# EasyEDA Pro project MSPM0G3507逐飞核心板.eprj

# Schematic Schematic1
Board Name: Board1; Create Date: 2025-07-05; Page Name: P1; Project Name: MSPM0G3507逐飞核心板; Schematic Name: Schematic1; Update Date: 2025-07-06; Company: 嘉立创EDA; Page Size: A4; Version: V1.0
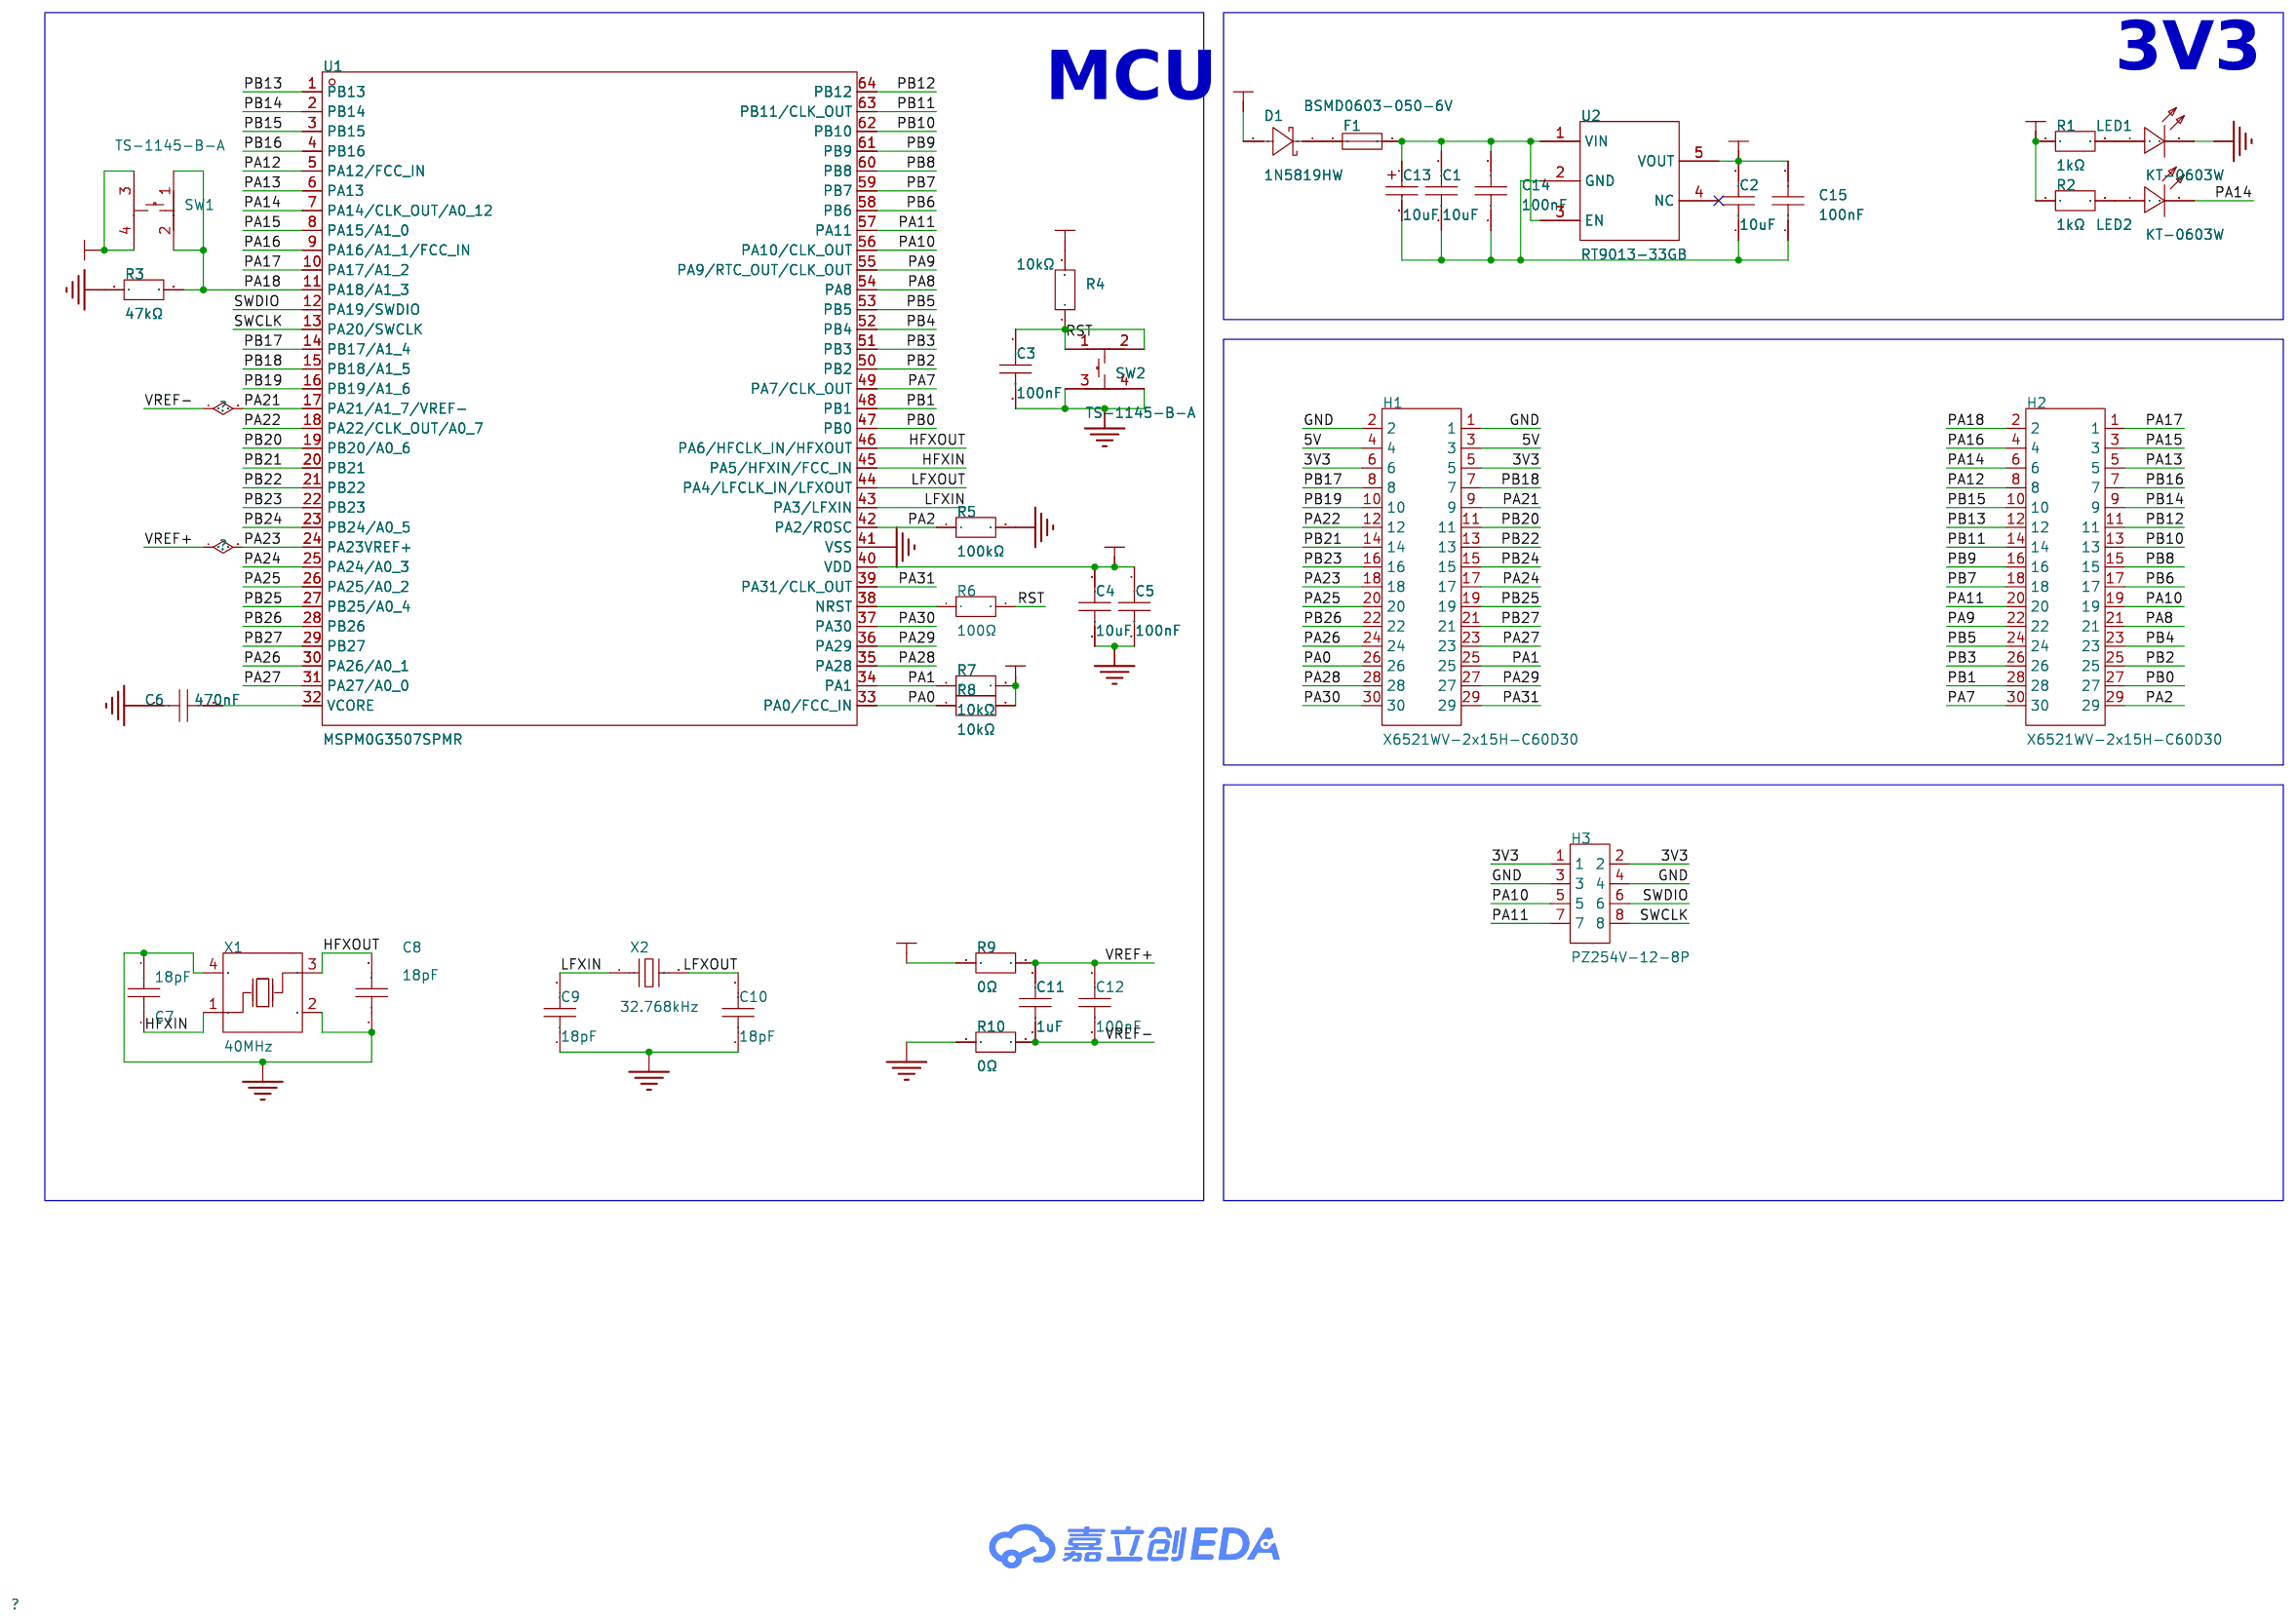
[diagram p0: schematic sheet]

## Parts
C1  10uF  [C0603]
C2  10uF  [C0603]
C3  100nF  [C0402]
C4  10uF  [C0603]
C5  100nF  [C0402]
C6  470nF  [C0402]
C7  18pF  [C0402]
C8  18pF  [C0402]
C9  18pF  [C0402]
C10  18pF  [C0402]
C11  1uF  [C0402]
C12  100nF  [C0402]
C13  10uF  [CAP-SMD_L3.2-W1.6-RD-C7171]
C14  100nF  [C0402]
C15  100nF  [C0402]
D1  1N5819HW  [SOD-123_L2.7-W1.6-LS3.7-RD-1]
F1  BSMD0603-050-6V  [F0603]
H1  X6521WV-2x15H-C60D30  [HDR-TH_30P-P2.54-V-M-R2-C15-S2.54-BL]
H2  X6521WV-2x15H-C60D30  [HDR-TH_30P-P2.54-V-M-R2-C15-S2.54-BL]
H3  PZ254V-12-8P  [HDR-TH_8P-P2.54-V-M-R2-C4-S2.54]
LED1  KT-0603W  [LED0603-R-RD_WHITE]
LED2  KT-0603W  [LED0603-R-RD_WHITE]
R1  1kΩ  [R0603]
R2  1kΩ  [R0603]
R3  47kΩ  [R0402]
R4  10kΩ  [R0402]
R5  100kΩ  [R0402]
R6  100Ω  [R0402]
R7  10kΩ  [R0603]
R8  10kΩ  [R0603]
R9  0Ω  [R0402]
R10  0Ω  [R0402]
SW1  TS-1145-B-A  [SW-SMD_4P-L4.2-W3.2-P2.15-LS4.6-2]
SW2  TS-1145-B-A  [SW-SMD_4P-L4.2-W3.2-P2.15-LS4.6-2]
U1  MSPM0G3507SPMR  [LQFP-64_L10.0-W10.0-P0.50-LS12.0-BL]
U2  RT9013-33GB  [SOT-23-5_L3.0-W1.7-P0.95-LS2.8-BL]
X1  40MHz  [OSC-SMD_4P-L3.2-W2.5-BL_SIT8008BI]
X2  32.768kHz  [OSC-SMD_L3.2-W1.5]

## Library data of the parts
C1 C2 = CGA0603X5R106K100JT: 容值:10uF;精度:±10%;额定电压:10V;材质(温度系数):X5R;; LCSC Part Name: 10uF ±10% 10V; Supplier Part: C6119842; Manufacturer: HRE(芯声); Supplier Footprint: 0603; JLCPCB Part Class: 扩展库; Supplier: LCSC; Tolerance: ±10%; Voltage Rated: 10V; Temperature Coefficient: X5R
C3 C5 C12 = CGA2B3X5R1H104K050BB: LCSC Part Name: 100nF ±10% 50V; Supplier Part: C2168987; Manufacturer: TDK; Supplier Footprint: 0402; JLCPCB Part Class: 扩展库; Datasheet: https://atta.szlcsc.com/upload/public/pdf/source/20210430/BD8671736ED62E65BA506F30C3AAED50.pdf; Supplier: LCSC; Tolerance: ±10%; Voltage Rated: 50V; Temperature Coefficient: X5R
C4 = 10uF_C15415: LCSC Part Name: 10uF ±20% 16V; Supplier Part: C15415; Manufacturer: SAMSUNG(三星); Supplier Footprint: 0603; JLCPCB Part Class: 扩展库; Datasheet: https://atta.szlcsc.com/upload/public/pdf/source/20160218/1457707763339.pdf; Supplier: LCSC; Tolerance: ±20%; Voltage Rated: 16V
C6 = C1005X5R1V474K050BC: LCSC Part Name: 470nF ±10% 35V; Supplier Part: C3852634; Manufacturer: TDK; Supplier Footprint: 0402; JLCPCB Part Class: 扩展库; Datasheet: https://atta.szlcsc.com/upload/public/pdf/source/20230606/A83975C7E70EF5AFCD4A17254ABD78F2.pdf; Supplier: LCSC; Tolerance: ±10%; Voltage Rated: 35V; Temperature Coefficient: X5R
C7-C10 = RF15N180J500CT: LCSC Part Name: 18pF ±5% 50V; Supplier Part: C384679; Manufacturer: Walsin(华新科); Supplier Footprint: 0402; JLCPCB Part Class: 扩展库; Datasheet: https://atta.szlcsc.com/upload/public/pdf/source/20190416/C384705_313B75924A9FB4466C261D14903A5486.pdf; Supplier: LCSC; Tolerance: ±5%; Voltage Rated: 50V; Temperature Coefficient: NP0
C11 = CGB2A1X5R1A105K033BC: LCSC Part Name: 1uF ±10% 10V; Supplier Part: C2169193; Manufacturer: TDK; Supplier Footprint: 0402; JLCPCB Part Class: 扩展库; Datasheet: https://atta.szlcsc.com/upload/public/pdf/source/20191105/C343012_3F47E91403558E3EBEE82CA44A798D40.pdf; Supplier: LCSC; Tolerance: ±10%; Voltage Rated: 10V; Temperature Coefficient: X5R
C13 = TAJA106K016RNJ: LCSC Part Name: 10uF ±10% 16V; Supplier Part: C7171; Manufacturer: Kyocera AVX; Supplier Footprint: CASE-A-3216-18(mm); JLCPCB Part Class: 基础库; Supplier: LCSC; Tolerance: ±10%; Voltage Rating: 16V; Equivalent Series Resistance(ESR): 3Ω@100kHz; Operating Temperature: -55℃~+125℃
C14 C15 = CL05B104KB54PNC: LCSC Part Name: 100nF ±10% 50V; Supplier Part: C307331; Manufacturer: SAMSUNG(三星); Supplier Footprint: 0402; JLCPCB Part Class: 基础库; Datasheet: https://atta.szlcsc.com/upload/public/pdf/source/20160218/1457707763339.pdf; Supplier: LCSC; Tolerance: ±10%; Voltage Rated: 50V; Temperature Coefficient: X7R
D1 = 1N5819HW: 二极管配置:-;正向压降(Vf):900mV@3A;直流反向耐压(Vr):40V;平均整流电流(Io):1A;; LCSC Part Name: 电压:40V 电流:1A; Supplier Part: C2905649; Manufacturer: TECH PUBLIC(台舟); Supplier Footprint: SOD-123; JLCPCB Part Class: 扩展库; Datasheet: https://atta.szlcsc.com/upload/public/pdf/source/20211020/8C6B6169F42B21129AF0D528B0E96B00.pdf; Supplier: LCSC; Forward Voltage (Vf@If): 900mV@3A; Reverse Voltage (Vr): 40V; Average Rectified Current (Io): 1A; Reverse Leakage Current (Ir): 1mA@40V
F1 = BSMD0603-050-6V: LCSC Part Name: 6V 500mA 0603自恢复; Supplier Part: C883095; Manufacturer: BHFUSE(佰宏); Supplier Footprint: 0603; JLCPCB Part Class: 扩展库; Datasheet: https://atta.szlcsc.com/upload/public/pdf/source/20230512/E478DE3555A0061DA0124A9F45802B86.pdf; Supplier: LCSC; Operating Voltage (Max): 6V; Current Rating (Max): 40A; Hold Current: 500mA; Trip Current: 1A; Power Dissipation: 500mW; Resistance - Initial (Ri) (Min): 100mΩ; Resistance - Post Trip (R1) (Max): 800mΩ; Maximum Time to Trip: 100ms; Operating Temperature: -40℃~+85℃
H1 H2 = X6521WV-2x15H-C60D30: LCSC Part Name: 2x15P 间距:2.54mm 方针; Supplier Part: C725887; Manufacturer: XKB Connection(中国星坤); Supplier Footprint: 插件,P=2.54mm; JLCPCB Part Class: 扩展库; Datasheet: https://atta.szlcsc.com/upload/public/pdf/source/20230814/F1C4971E164A170E66FC7330ABFF6881.pdf; Supplier: LCSC; Pin Structure: 2x15P; Pitch: 2.54mm; Row Spacing: 2.54mm; Circluar Pins/Square Pins: 方针; Number of Rows: 双排; Number of Pins: 30P; Current Rating: 3A; Voltage Rating (Max): 250V; Insulation Height: 2.5mm; Contact Material: 黄铜; Contact Plating: 金; Operating Temperature: -40℃~+105℃; Color: 黑色
H3 = PZ254V-12-8P: LCSC Part Name: 2x4P 间距:2.54mm 方针 直插; Supplier Part: C492421; Manufacturer: XFCN(兴飞); Supplier Footprint: 插件,P=2.54mm; JLCPCB Part Class: 扩展库; Datasheet: https://atta.szlcsc.com/upload/public/pdf/source/20200309/C492421_DC8A206AF99CD7755BD4A5B0BC48200B.pdf; Supplier: LCSC; Pin Structure: 2x4P; Pitch: 2.54mm; Row Spacing: 2.54mm; Circluar Pins/Square Pins: 方针; Mounting Type: 直插; Number of Rows: 双排; Number of Pins: 8P; Length of Mating Pin: 6mm; Insulation Height: 2.5mm; Length of End Connection Pin: 3mm; Contact Material: 黄铜; Operating Temperature: -40℃~+105℃; Color: 黑色
LED1 LED2 = KT-0603W: LCSC Part Name: 0603 白灯 高亮; Supplier Part: C2290; Manufacturer: KENTO; Supplier Footprint: 0603; JLCPCB Part Class: 基础库; Datasheet: https://atta.szlcsc.com/upload/public/pdf/source/20221101/4C23D5C85BA051E44A00B833D0A41468.pdf; Supplier: LCSC; Emitted Color: 白色
R1 R2 = SY0603BD1KP: LCSC Part Name: 厚膜电阻 1kΩ ±0.1% 62.5mW; Supplier Part: C2913953; Manufacturer: SANYEAR(叁叶源); Supplier Footprint: 0603; JLCPCB Part Class: 扩展库; Datasheet: https://atta.szlcsc.com/upload/public/pdf/source/20210413/C2763786_98157E1BD2D9D1A8B4147C58C12D38F2.pdf; Supplier: LCSC; Type: 厚膜电阻; Tolerance: ±0.1%; Power(Watts): 62.5mW; Temperature Coefficient: ±25ppm/℃
R3 = TD03H4702FT: LCSC Part Name: 47kΩ ±1% 100mW; Supplier Part: C7471593; Manufacturer: FH(风华); Supplier Footprint: 0603; JLCPCB Part Class: 扩展库; Datasheet: https://atta.szlcsc.com/upload/public/pdf/source/20230801/D9B071711038885C5E715CC01846F136.pdf; Supplier: LCSC; Tolerance: ±1%; Power(Watts): 100mW; Temperature Coefficient: ±50ppm/℃
R4 R5 R7 R8 = RG1608N-103-D-T5: LCSC Part Name: 薄膜电阻 10kΩ ±0.5% 100mW; Supplier Part: C2146774; Manufacturer: SUSUMU; Supplier Footprint: 0603; JLCPCB Part Class: 扩展库; Datasheet: https://atta.szlcsc.com/upload/public/pdf/source/20210604/C332225_945ECB787E58A490E925D92B7707E1BB.pdf; Supplier: LCSC; Type: 薄膜电阻; Tolerance: ±0.5%; Power(Watts): 100mW; Voltage-Supply(Max): 100V; Temperature Coefficient: ±10ppm/℃; Operating Temperature: -55℃~+155℃
R6 = RNCP0603FTD100R: LCSC Part Name: 薄膜电阻 100Ω ±1% 125mW; Supplier Part: C2479153; Manufacturer: SEI(Stackpole Electronics Inc.); Supplier Footprint: 0603; JLCPCB Part Class: 扩展库; Datasheet: https://atta.szlcsc.com/upload/public/pdf/source/20210703/569BB8B726E815480678B80ABD78296B.pdf; Supplier: LCSC; Type: 薄膜电阻; Tolerance: ±1%; Power(Watts): 125mW; Overload Voltage (Max): 150V; Temperature Coefficient: ±100ppm/℃; Operating Temperature Range: -55℃~+155℃
R9 R10 = SCR0402J0R: LCSC Part Name: 厚膜电阻 0Ω ±5% 62.5mW; Supplier Part: C3017451; Manufacturer: VO(翔胜); Supplier Footprint: 0402; JLCPCB Part Class: 扩展库; Datasheet: https://atta.szlcsc.com/upload/public/pdf/source/20220513/247AF9639BA21CF93567DC289CCC6A22.pdf; Supplier: LCSC; Type: 厚膜电阻; Tolerance: ±5%; Power(Watts): 62.5mW; Overload Voltage (Max): 50V; Operating Temperature Range: -55℃~+155℃
SW1 SW2 = TS-1145-B-A: 电路结构:单刀单掷;按钮形状:椭圆形按钮;作用力:160gf;安装方式:立贴;开关长度:4.2mm;开关宽度:3.2mm;开关高度:2.5mm;带支架:不带;触点电流:50mA;额定电压(DC):12V;绝缘电阻:-;带灯:无;机械寿命:10万次;; LCSC Part Name: 4.2*3.2*2.5mm 立贴 轻触开关; Supplier Part: C561524; Manufacturer: XKB Connectivity(中国星坤); Supplier Footprint: SMD; JLCPCB Part Class: 扩展库; Datasheet: https://atta.szlcsc.com/upload/public/pdf/source/20211011/0CF8142AA4E06969C17548F8C3FC4FC4.pdf; Supplier: LCSC; Circuit: 单刀单掷; Actuator Style: 椭圆形按钮; Operating Force: 160gf; Mounting Style: 立贴; Switch Length: 4.2mm; Switch Width: 3.2mm; Switch Height: 2.5mm; Strike Gundam: 不带; Contact Current: 50mA; Voltage Rating (DC): 12V; Actuator/Cap Color: 白色; With Lamp: 无; Mechanical Life: 10万次; Operating Temperature: -30℃~+85℃
U1 = MSPM0G3507SPMR_C22389960: Supplier Part: C22389960; Manufacturer: TI(德州仪器); Supplier Footprint: LQFP-64(10x10); JLCPCB Part Class: 扩展库; Supplier: LCSC
U2 = RT9013-33GB: 输出类型:固定;最大输入电压:5.5V;输出电压:3.3V;输出电流:500mA;电源纹波抑制比(PSRR):50dB@(10kHz);输出极性:正极;; LCSC Part Name: 输入5.5V 输出3.3V 500mA; Supplier Part: C47773; Manufacturer: RICHTEK(立锜); Supplier Footprint: SOT-23-5; JLCPCB Part Class: 扩展库; Datasheet: https://atta.szlcsc.com/upload/public/pdf/source/20150504/1457707282459.pdf; Supplier: LCSC; Output Type: 固定; Maximum Input Voltage: 5.5V; Output Voltage: 3.3V; Output Current: 500mA; Power Supply Rejection Ratio (PSRR): 50dB@(10kHz); Dropout Voltage: 400mV@(500mA); standby current: 50uA; Feature: 低ESR；防静电保护；热保护(TSD)；过流保护(OCP)；带使能; Operating Temperature: -40℃~+85℃; Output Polarity: 正极; Number of Outputs: 1
X1 = X322540MPB4SI: LCSC Part Name: YSX321SL 40MHZ 4P 3225 15PF ±10PPM -40~85℃ (±20PPM); Supplier Part: C9010; Manufacturer: YXC(扬兴晶振); Supplier Footprint: SMD3225-4P; JLCPCB Part Class: 扩展库; Datasheet: https://atta.szlcsc.com/upload/public/pdf/source/20240329/19D5F850207469550BEB00D7DFEDBC7A.pdf; Supplier: LCSC; Type: 贴片晶振; Normal temperature Frequency Tolerance: ±10ppm; Load Capacitance: 15pF; Frequency Stability: ±20ppm; Operating Temperature: -40℃~+85℃
X2 = X321532768KGD2SI: LCSC Part Name: YST310S 32.768KHZ 2P 3215 12.5PF ±20PPM -40~85℃; Supplier Part: C620155; Manufacturer: YXC(扬兴晶振); Supplier Footprint: SMD3215-2P; JLCPCB Part Class: 扩展库; Datasheet: https://atta.szlcsc.com/upload/public/pdf/source/20240329/3A7650FD985DD0DE85694D3785AB4916.pdf; Supplier: LCSC; Type: 贴片晶振; Normal temperature Frequency Tolerance: ±20ppm; Load Capacitance: 12.5pF; Frequency Stability: ±30ppm; Operating Temperature: -40℃~+85℃

## Nets
3V3: C2.2 C4.1 C5.1 C15.2 H1.5 H1.6 H3.1 H3.2 R1.1 R2.1 R4.2 R7.2 R8.2 R9.1 SW1.3 SW1.4 U1.40(VDD) U2.5(VOUT)
5V: D1.2(A) H1.3 H1.4
GND: C3.2 C4.2 C5.2 C6.1 C7.2 C8.1 C9.1 C10.1 H1.1 H1.2 H3.3 H3.4 LED1.2(K) R3.1 R5.2 R10.1 SW2.3 SW2.4 U1.41(VSS) X1.2(GND) X1.4(GND)
HFXIN: C7.1 U1.45(PA5/HFXIN/FCC_IN) X1.1(OSC1)
HFXOUT: C8.2 U1.46(PA6/HFCLK_IN/HFXOUT) X1.3(OSC2)
LFXIN: C9.2 U1.43(PA3/LFXIN) X2.1
LFXOUT: C10.2 U1.44(PA4/LFCLK_IN/LFXOUT) X2.2
PA0: H1.26 R8.1 U1.33(PA0/FCC_IN)
PA1: H1.25 R7.1 U1.34(PA1)
PA2: H2.29 R5.1 U1.42(PA2/ROSC)
PA7: H2.30 U1.49(PA7/CLK_OUT)
PA8: H2.21 U1.54(PA8)
PA9: H2.22 U1.55(PA9/RTC_OUT/CLK_OUT)
PA10: H2.19 H3.5 U1.56(PA10/CLK_OUT)
PA11: H2.20 H3.7 U1.57(PA11)
PA12: H2.8 U1.5(PA12/FCC_IN)
PA13: H2.5 U1.6(PA13)
PA14: H2.6 LED2.2(K) U1.7(PA14/CLK_OUT/A0_12)
PA15: H2.3 U1.8(PA15/A1_0)
PA16: H2.4 U1.9(PA16/A1_1/FCC_IN)
PA17: H2.1 U1.10(PA17/A1_2)
PA18: H2.2 R3.2 SW1.1 SW1.2 U1.11(PA18/A1_3)
PA21: C11.2 C12.2 H1.9 R10.2 U1.17(PA21/A1_7/VREF-)
PA22: H1.12 U1.18(PA22/CLK_OUT/A0_7)
PA23: C11.1 C12.1 H1.18 R9.2 U1.24(PA23VREF+)
PA24: H1.17 U1.25(PA24/A0_3)
PA25: H1.20 U1.26(PA25/A0_2)
PA26: H1.24 U1.30(PA26/A0_1)
PA27: H1.23 U1.31(PA27/A0_0)
PA28: H1.28 U1.35(PA28)
PA29: H1.27 U1.36(PA29)
PA30: H1.30 U1.37(PA30)
PA31: H1.29 U1.39(PA31/CLK_OUT)
PB0: H2.27 U1.47(PB0)
PB1: H2.28 U1.48(PB1)
PB2: H2.25 U1.50(PB2)
PB3: H2.26 U1.51(PB3)
PB4: H2.23 U1.52(PB4)
PB5: H2.24 U1.53(PB5)
PB6: H2.17 U1.58(PB6)
PB7: H2.18 U1.59(PB7)
PB8: H2.15 U1.60(PB8)
PB9: H2.16 U1.61(PB9)
PB10: H2.13 U1.62(PB10)
PB11: H2.14 U1.63(PB11/CLK_OUT)
PB12: H2.11 U1.64(PB12)
PB13: H2.12 U1.1(PB13)
PB14: H2.9 U1.2(PB14)
PB15: H2.10 U1.3(PB15)
PB16: H2.7 U1.4(PB16)
PB17: H1.8 U1.14(PB17/A1_4)
PB18: H1.7 U1.15(PB18/A1_5)
PB19: H1.10 U1.16(PB19/A1_6)
PB20: H1.11 U1.19(PB20/A0_6)
PB21: H1.14 U1.20(PB21)
PB22: H1.13 U1.21(PB22)
PB23: H1.16 U1.22(PB23)
PB24: H1.15 U1.23(PB24/A0_5)
PB25: H1.19 U1.27(PB25/A0_4)
PB26: H1.22 U1.28(PB26)
PB27: H1.21 U1.29(PB27)
RST: C3.1 R4.1 R6.2 SW2.1 SW2.2
SWCLK: H3.8 U1.13(PA20/SWCLK)
SWDIO: H3.6 U1.12(PA19/SWDIO)
$1N614: C6.2 U1.32(VCORE)
$1N707: R6.1 U1.38(NRST)
$1N3253: LED1.1(A) R1.2
$1N3286: LED2.1(A) R2.2
Net-(C1-1): C1.1 C2.1 C13.2 C14.1 C15.1 U2.2(GND)
Net-(C1-2): C1.2 C13.1 C14.2 F1.2 U2.1(VIN) U2.3(EN)
Net-(D1-1): D1.1(K) F1.1

Not connected (* = marked no-connect by the designer): U2 4(NC)*

## Notes on the sheet
- 3V3
- MCU

# Board PCB1
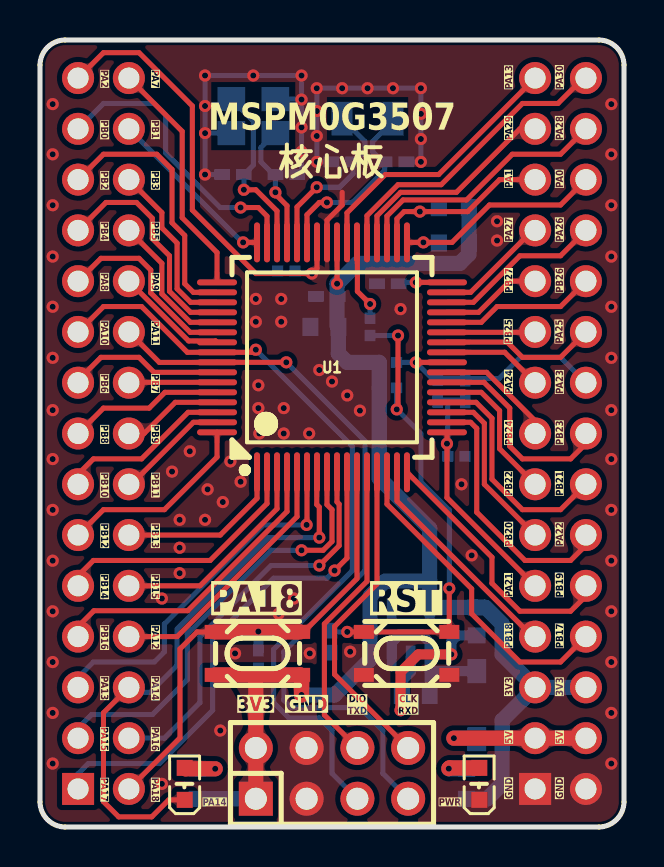
[diagram p1: board, top side]
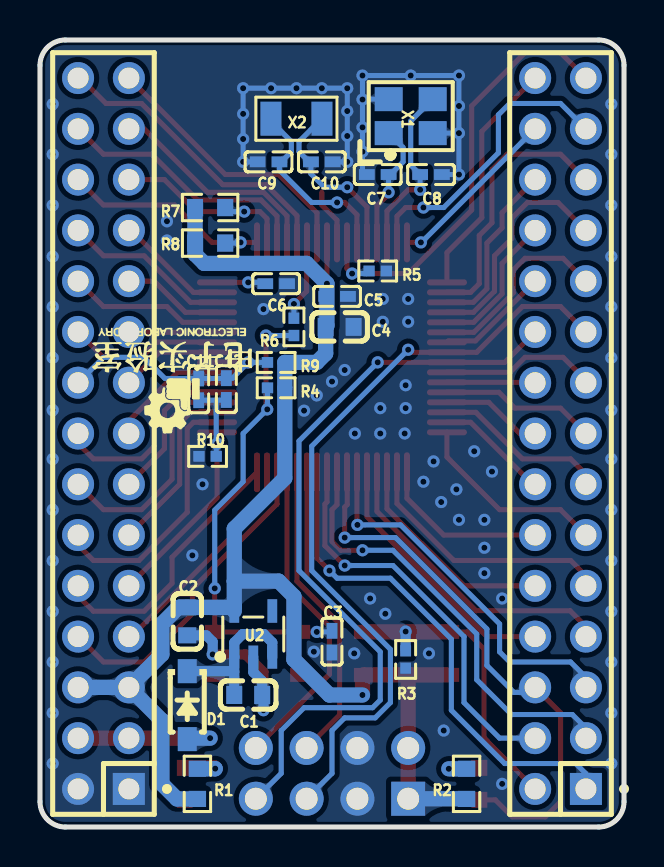
[diagram p2: board, bottom side, seen from below]

Outline 29.21 x 39.37 mm; copper layers: Top Layer, Bottom Layer. Coordinates in mm from the lower left corner of the outline.
Outline path: 0,38.1 0,1.27 arc(0.37,0.37) 1.27,0 27.94,0 arc(28.84,0.37) 29.21,1.27 29.21,38.1 arc(28.84,39) 27.94,39.37 1.27,39.37 arc(0.37,39) 0,38.1
Stack: Top Layer 0.035mm / Dielectric1 1.51mm FR4 er 4.5 / Bottom Layer 0.035mm

## Design rules (mm)
template: 自定义配置
spacing copperThickness1oz (default): track to track 0.102, other pairs 0.152 to 0.3
spacing copperThickness2oz: track to track 0.203, other pairs 0.152 to 0.3
track width copperThickness1oz (default): min 0.127, default 0.254, max 2.54
track width copperThickness2oz: min 0.203, default 0.254, max 2.54
differential pair differentialPair (default): width min 0.127, default 0.254, max 2.54; gap min 0.152, default 0.152
via viaSize (default): diameter min 0.5, default 0.61, max 10; hole min 0.3, default 0.305, max 6.3

## Placement (name value [footprint] x y rotation side)
C1  10uF  [C0603]  18.8 6.6 0 bottom
C2  10uF  [C0603]  21.84 10.29 90 bottom
C3  100nF  [C0402]  14.6 9.27 270 bottom
C4  10uF  [C0603]  14.22 25.02 180 bottom
C5  100nF  [C0402]  14.35 26.54 180 bottom
C6  470nF  [C0402]  17.4 27.18 0 bottom
C7  18pF  [C0402]  12.32 32.64 0 bottom
C8  18pF  [C0402]  9.65 32.64 0 bottom
C9  18pF  [C0402]  17.78 33.27 180 bottom
C10  18pF  [C0402]  15.11 33.27 0 bottom
C11  1uF  [C0402]  21.27 21.89 270 bottom
C12  100nF  [C0402]  19.89 21.91 270 bottom
D1  1N5819HW  [SOD-123_L2.7-W1.6-LS3.7-RD-1]  21.84 6.1 270 bottom
H1  X6521WV-2x15H-C60D30  [HDR-TH_30P-P2.54-V-M-R2-C15-S2.54-BL]  26.03 19.69 90 bottom
H2  X6521WV-2x15H-C60D30  [HDR-TH_30P-P2.54-V-M-R2-C15-S2.54-BL]  3.17 19.69 90 bottom
H3  PZ254V-12-8P  [HDR-TH_8P-P2.54-V-M-R2-C4-S2.54]  14.6 2.69 0 top
LED1  KT-0603W  [LED0603-R-RD_WHITE]  21.97 2.16 90 top
LED2  KT-0603W  [LED0603-R-RD_WHITE]  7.24 2.16 90 top
R1  1kΩ  [R0603]  21.34 2.16 90 bottom
R2  1kΩ  [R0603]  7.87 2.16 90 bottom
R3  47kΩ  [R0402]  10.92 8.38 90 bottom
R4  10kΩ  [R0402]  17.4 21.97 180 bottom
R5  100kΩ  [R0402]  12.32 27.81 180 bottom
R6  100Ω  [R0402]  16.51 25.02 270 bottom
R7  10kΩ  [R0603]  20.7 30.99 0 bottom
R8  10kΩ  [R0603]  20.7 29.21 0 bottom
R9  0Ω  [R0402]  17.4 23.24 0 bottom
R10  0Ω  [R0402]  20.83 18.54 180 bottom
SW1  TS-1145-B-A  [SW-SMD_4P-L4.2-W3.2-P2.15-LS4.6-2]  10.88 8.69 0 top
SW2  TS-1145-B-A  [SW-SMD_4P-L4.2-W3.2-P2.15-LS4.6-2]  18.33 8.69 0 top
U1  MSPM0G3507SPMR  [LQFP-64_L10.0-W10.0-P0.50-LS12.0-BL]  14.6 23.5 0 top
U2  RT9013-33GB  [SOT-23-5_L3.0-W1.7-P0.95-LS2.8-BL]  18.54 9.65 180 bottom
X1  40MHz  [OSC-SMD_4P-L3.2-W2.5-BL_SIT8008BI]  10.67 35.56 180 bottom
X2  32.768kHz  [OSC-SMD_L3.2-W1.5]  16.38 35.43 180 bottom

## Footprints (pads in the part's own frame, mm; a bottom-side part is the same pattern mirrored in y, then rotated)
C0402
  rect 0.79x0.54 smd: 1(-0.545,0) 2(0.545,0)
C0603
  rect 0.8x0.9 smd: 1(-0.7,0) 2(0.7,0)
HDR-TH_8P-P2.54-V-M-R2-C4-S2.54
  rect 1.7x1.7 hole 1.1: 1(-3.81,-1.27)
  round 1.7 hole 1.1: 2(-3.81,1.27) 3(-1.27,-1.27) 4(-1.27,1.27) 5(1.27,-1.27) 6(1.27,1.27) 7(3.81,-1.27) 8(3.81,1.27)
HDR-TH_30P-P2.54-V-M-R2-C15-S2.54-BL
  rect 1.6x1.6 hole 1.05: 1(-17.78,-1.27)
  round 1.6 hole 1.05: 2(-17.78,1.27) 3(-15.24,-1.27) 4(-15.24,1.27) 5(-12.7,-1.27) 6(-12.7,1.27) 7(-10.16,-1.27) 8(-10.16,1.27) 9(-7.62,-1.27) 10(-7.62,1.27) 11(-5.08,-1.27) 12(-5.08,1.27) 13(-2.54,-1.27) 14(-2.54,1.27) 15(0,-1.27) 16(0,1.27) 17(2.54,-1.27) 18(2.54,1.27) 19(5.08,-1.27) 20(5.08,1.27) 21(7.62,-1.27) 22(7.62,1.27) 23(10.16,-1.27) 24(10.16,1.27) 25(12.7,-1.27) 26(12.7,1.27) 27(15.24,-1.27) 28(15.24,1.27) 29(17.78,-1.27) 30(17.78,1.27)
LED0603-R-RD_WHITE
  rect 0.8x0.8 smd: 1(0.8,0) 2(-0.8,0)
LQFP-64_L10.0-W10.0-P0.50-LS12.0-BL
  oval 0.3x2 smd: 1(-3.75,-5.75) 2(-3.25,-5.75) 3(-2.75,-5.75) 4(-2.25,-5.75) 5(-1.75,-5.75) 6(-1.25,-5.75) 7(-0.75,-5.75) 8(-0.25,-5.75) 9(0.25,-5.75) 10(0.75,-5.75) 11(1.25,-5.75) 12(1.75,-5.75) 13(2.25,-5.75) 14(2.75,-5.75) 15(3.25,-5.75) 16(3.75,-5.75) 33(3.75,5.75) 34(3.25,5.75) 35(2.75,5.75) 36(2.25,5.75) 37(1.75,5.75) 38(1.25,5.75) 39(0.75,5.75) 40(0.25,5.75) 41(-0.25,5.75) 42(-0.75,5.75) 43(-1.25,5.75) 44(-1.75,5.75) 45(-2.25,5.75) 46(-2.75,5.75) 47(-3.25,5.75) 48(-3.75,5.75)
  oval 2x0.3 smd: 17(5.75,-3.75) 18(5.75,-3.25) 19(5.75,-2.75) 20(5.75,-2.25) 21(5.75,-1.75) 22(5.75,-1.25) 23(5.75,-0.75) 24(5.75,-0.25) 25(5.75,0.25) 26(5.75,0.75) 27(5.75,1.25) 28(5.75,1.75) 29(5.75,2.25) 30(5.75,2.75) 31(5.75,3.25) 32(5.75,3.75) 49(-5.75,3.75) 50(-5.75,3.25) 51(-5.75,2.75) 52(-5.75,2.25) 53(-5.75,1.75) 54(-5.75,1.25) 55(-5.75,0.75) 56(-5.75,0.25) 57(-5.75,-0.25) 58(-5.75,-0.75) 59(-5.75,-1.25) 60(-5.75,-1.75) 61(-5.75,-2.25) 62(-5.75,-2.75) 63(-5.75,-3.25) 64(-5.75,-3.75)
OSC-SMD_4P-L3.2-W2.5-BL_SIT8008BI
  rect 1.4x1.2 smd: 1(-1.1,-0.85) 2(1.1,-0.85) 3(1.1,0.85) 4(-1.1,0.85)
OSC-SMD_L3.2-W1.5
  rect 1.05x1.7 smd: 1(-1.275,0) 2(1.275,0)
R0402
  rect 0.566x0.54 smd: 1(-0.433,0) 2(0.433,0)
R0603
  rect 0.806x0.864 smd: 1(-0.753,0) 2(0.753,0)
SOD-123_L2.7-W1.6-LS3.7-RD-1
  rect 1.2x0.95 smd: 1(-1.7,0) 2(1.7,0)
SOT-23-5_L3.0-W1.7-P0.95-LS2.8-BL
  rect 0.49x1.157 smd: 1(-0.95,-1.153) 2(0,-1.153) 3(0.95,-1.153)
  rect 0.49x1.175 smd: 4(0.95,1.153) 5(-0.95,1.153)
SW-SMD_4P-L4.2-W3.2-P2.15-LS4.6-2
  rect 1x0.7 smd: 1(-2.136,1.075) 2(2.135,1.075) 3(-2.135,-1.075) 4(2.135,-1.075)

## Nets
As in the schematic, except:
$1N2317: C1.2 D1.1 U2.1 U2.3
$1N5118: C1.1 C2.1 U2.2

Pads without a net: U2 4

## Via types
v1: diameter 0.61, hole 0.305, Top Layer to Bottom Layer, 117 vias

## Routing (per net, layer and track width the routed paths; a pad name or vN(x,y) marks a point on that pad's centre or on a via; arc(x,y) is an arc through that point)
3V3: length 73.9
  Top Layer w0.254: U1.40 14.86,29.24 v1(14.86,27.18)
  Top Layer w0.762: 10.67,7.61 10.79,7.49 H3.2 H3.1 ; 10.67,7.61 SW1.4 13.08,7.54 v1(13.08,6.6) ; 10.67,7.61 SW1.3
  Bottom Layer w0.762: H3.1 7.88,1.41 R2.1 ; H1.5 23.11,5.33 23.11,2.16 22.36,1.41 R1.1 ; H1.5 H1.6 ; H1.5 23.11,8.64 23.11,10.16 22.29,10.99 C2.2 19.53,10.99 19.49,11.02 ; v1(13.08,6.6) 14.73,6.6 16.51,8.38 16.51,11.54 17.27,12.3 19.49,12.3 ; 19.49,12.3 19.49,14.92 16.97,17.45 16.97,23.24 15.37,23.24 14.92,23.68 C4.1 14.86,25.08 v1(14.86,27.18) 15.88,28.19 21,28.19 21.45,28.65 R8.2 R7.2 ; 19.49,12.3 19.49,11.02 ; 19.49,11.02 U2.5
5V: length 7.8
  Top Layer w0.762: H1.4 H1.3 v1(20.7,4.45)
  Bottom Layer w0.762: D1.2 21.79,4.45 v1(20.7,4.45)
GND: length 35.2
  Top Layer w0.254: 15.11,31.75 15.11,31.12 14.35,30.36 U1.41
  Bottom Layer w0.254: C8.1 v1(8.25,32.64) 8.25,34.71 ; 11.77,36.41 13.06,36.41 v1(13.08,36.39) ; 8.25,34.71 v1(8.25,36.07) v1(8.25,37.59) v1(10.67,37.59) v1(13.08,37.59) v1(13.08,36.39) ; 8.25,34.71 v1(8.26,34.71) X1.2 ; C9.1 v1(19.05,33.27) v1(19.05,34.42) v1(19.05,35.67) v1(19.05,36.96) v1(17.65,36.96) v1(16.38,36.96) v1(15.11,36.96) v1(13.84,36.96) v1(13.84,35.81) v1(13.84,34.57) v1(13.84,33.27) C10.1 ; C7.2 13.08,32.86 v1(13.08,33.78) v1(13.08,35) v1(13.08,36.39)
  vias: v1(0.63,36.16) v1(0.63,33.65) v1(0.63,31.1) v1(0.63,28.54) v1(0.63,26.03) v1(0.63,23.47) v1(0.63,20.85) v1(0.63,18.41) v1(0.63,15.86) v1(0.63,13.32) v1(0.63,10.79) v1(0.63,8.25) v1(0.63,5.71) v1(0.63,3.17) v1(6.1,11.43) v1(6.1,2.16) v1(6.6,17.78) v1(6.98,15.37) v1(6.98,13.97) v1(6.98,12.7) v1(7.49,18.8) v1(8.25,15.37) v1(8.38,16.89) v1(9.02,4.83) v1(9.14,16.26) v1(9.52,18.29) v1(9.76,8.69) v1(10.03,17.27) v1(10.79,26.42) v1(10.79,25.27) v1(10.92,22.1) v1(10.92,20.95) v1(10.97,19.69) v1(11.94,10.67) v1(12.06,26.42) v1(12.06,25.27) v1(12.19,20.95) v1(12.19,19.69) v1(12.7,11.43) v1(13.46,19.69) v1(13.49,8.69) v1(13.97,22.86) v1(14.6,22.28) v1(15.37,21.59) v1(15.51,8.77) v1(16,20.83) v1(18.03,25.91) v1(21.08,17.14) v1(21.59,13.59) v1(22.86,30.3) v1(22.86,29.34) v1(28.57,36.16) v1(28.57,33.65) v1(28.57,31.1) v1(28.57,28.54) v1(28.57,26.03) v1(28.57,23.47) v1(28.57,20.85) v1(28.57,18.41) v1(28.57,15.86) v1(28.57,13.32) v1(28.57,10.79) v1(28.57,8.25) v1(28.57,5.71) v1(28.57,3.17)
HFXIN: length 6.4
  Top Layer w0.254: U1.45 12.35,31.08 11.77,31.66 v1(11.77,31.75)
  Bottom Layer w0.254: v1(11.77,31.75) C7.1 11.68,32.64 11.05,33.27 11.05,33.99 11.77,34.71
HFXOUT: length 8.9
  Top Layer w0.254: U1.46 11.85,30.82 10.79,31.88 v1(10.2,31.88)
  Bottom Layer w0.254: X1.3 10.67,35.31 10.67,33.11 C8.2 v1(10.2,31.88)
LFXIN: length 9.5
  Top Layer w0.254: U1.43 13.35,30.63 13.97,31.24 v1(14.35,31.24)
  Bottom Layer w0.254: v1(14.35,31.24) 15.62,31.24 17.23,32.86 C9.2 17.14,33.27 16.64,33.78 16.64,34.29 17.66,35.31 X2.1
LFXOUT: length 8.8
  Top Layer w0.254: U1.44 12.85,31.02 v1(13.84,32)
  Bottom Layer w0.254: X2.2 15.11,35.43 16.26,34.29 16.26,33.78 15.75,33.27 C10.2 15.66,32.68 14.99,32 v1(13.84,32)
PA0: length 10.7
  Top Layer w0.254: U1.33 v1(19.18,29.25) 20.61,29.25 22.48,31.12 26.03,31.12 27.05,32.13
  Bottom Layer w0.254: R8.1 19.21,29.21 v1(19.18,29.25)
PA1: length 9.9
  Top Layer w0.254: U1.34 17.85,30.43 18.21,30.78 v1(19,30.78) 21.39,30.78 22.99,32.39 H1.25
  Bottom Layer w0.254: R7.1 19.74,30.78 v1(19,30.78)
PA2: length 22.4
  Top Layer w0.254: H2.29 3.17,38.73 4.95,38.73 7.62,36.07 7.62,30.86 10.79,27.69 v1(13.6,27.69) 13.85,27.94 U1.42
  Bottom Layer w0.254: R5.1 12.88,27.69 v1(13.6,27.69)
PA7: length 12
  Top Layer w0.254: U1.49 8.85,28.74 7.11,30.48 7.11,34.8 H2.30
PA8: length 9.3
  Top Layer w0.254: U1.54 7.51,24.75 5.54,26.72 5.54,27.86 4.95,28.45 3.05,28.45 2.16,27.56
PA9: length 5.7
  Top Layer w0.254: H2.22 7.43,24.32 8.78,24.32 U1.55
PA10: length 38.8
  Top Layer w0.254: 2.16,25.02 3.17,26.03 5.08,26.03 7.37,23.75 U1.56 10.66,23.75 v1(10.79,23.88)
  Bottom Layer w0.254: v1(10.79,23.88) 15.62,19.05 15.62,12.83 11.68,8.89 11.68,6.22 12.45,5.46 13.97,5.46 14.6,4.83 14.6,2.69 H3.5
PA11: length 38.2
  Top Layer w0.254: v1(12.32,23.25) U1.57 8.85,23.24 5.97,23.24 H2.20
  Bottom Layer w0.254: v1(12.32,23.25) 16.26,19.31 16.26,12.83 12.19,8.76 12.19,6.35 12.57,5.97 16,5.97 17.14,4.83 17.14,2.69 H3.7
PA12: length 13.1
  Top Layer w0.254: H2.8 6.86,9.53 12.85,15.52 U1.5
PA13: length 18.4
  Top Layer w0.254: U1.6 13.35,15.13 v1(13.33,15.11)
  Bottom Layer w0.254: 1.65,7.24 2.67,8.25 5.72,8.25 6.22,8.76 6.22,10.16 11.18,15.11 v1(13.33,15.11)
PA14: length 27.8
  Top Layer w0.254: H2.6 3.17,5.72 3.17,1.27 3.94,0.51 5.59,0.51 6.44,1.36 LED2.2 ; v1(13.97,14.48) 13.97,16 13.84,16.13 13.84,17.73 U1.7
  Bottom Layer w0.254: v1(13.97,14.48) 11.43,14.48 6.86,9.91 6.86,8.09 5.51,6.73 4.7,6.73
PA15: length 21.8
  Top Layer w0.254: U1.8 14.35,16.12 14.6,15.88 14.6,14.29 14.16,13.84 v1(13.08,13.84)
  Bottom Layer w0.254: v1(13.08,13.84) 11.56,13.84 7.37,9.65 7.37,7.37 5.63,5.63 2.58,5.63 1.65,4.7
PA16: length 20.2
  Top Layer w0.254: v1(13.97,13.08) 14.96,14.07 14.96,16.15 14.85,16.26 U1.9
  Bottom Layer w0.254: H2.4 6.22,4.45 8,6.22 8,9.53 11.56,13.08 v1(13.97,13.08)
PA17: length 25.1
  Top Layer w0.254: U1.10 15.35,13.45 v1(14.73,12.83)
  Bottom Layer w0.254: H2.1 1.91,2.67 2.41,3.17 5.97,3.17 8.64,5.84 8.64,9.4 11.68,12.45 14.35,12.45 v1(14.73,12.83)
PA18: length 24.5
  Top Layer w0.254: 13.19,9.76 15.85,12.43 U1.11 ; SW1.1 7.85,9.76 7,8.91 7,4.46 H2.2
  Top Layer w0.762: SW1.2 SW1.1
  Bottom Layer w0.508: R3.2 v1(10.92,9.78)
PA21: length 13.7
  Top Layer w0.254: H1.9 20.35,16.48 v1(20.35,19.18) U1.17
  Bottom Layer w0.254: C12.2 19.9,21.35 20.42,21.35 ; C11.2 20.42,21.35 ; 20.42,21.35 20.39,21.33 R10.2
PA22: length 13.5
  Top Layer w0.254: 27.56,14.86 27.66,14.75 27.66,14.46 26.54,13.34 24.26,13.34 21.84,15.75 21.84,19.94 21.54,20.25 U1.18
PA23: length 12.3
  Top Layer w0.254: v1(18.8,23.24) 20.35,23.24 U1.24
  Bottom Layer w0.254: H1.18 26.03,23.5 24.02,23.5 22.96,22.44 C11.1 19.9,22.44 C12.1 19.58,22.45 v1(18.8,23.24) R9.2
PA24: length 5
  Top Layer w0.254: U1.25 20.36,23.75 23.24,23.75 H1.17
PA25: length 7.4
  Top Layer w0.254: 27.05,24.51 26.03,23.5 24.13,23.5 23.37,24.26 20.37,24.26 U1.26
PA26: length 8.1
  Top Layer w0.254: 27.05,29.59 26.03,28.58 24,28.58 21.67,26.25 U1.30
PA27: length 5.7
  Top Layer w0.254: U1.31 21.54,26.75 24.64,29.84 H1.23
PA28: length 12.7
  Top Layer w0.254: U1.35 17.35,30.56 18.16,31.37 21.34,31.37 23.62,33.66 26.03,33.66 27.05,34.67
PA29: length 11
  Top Layer w0.254: U1.36 16.85,30.57 18.03,31.75 20.83,31.75 24,34.92 H1.27
PA30: length 15.1
  Top Layer w0.254: H1.30 27.18,37.47 25.91,36.2 24.13,36.2 20.07,32.13 17.91,32.13 16.35,30.58 U1.37
PA31: length 14.1
  Top Layer w0.254: 25.02,37.21 25.12,37.32 25.12,37.61 ; U1.39 15.35,30.72 17.27,32.64 19.94,32.64 H1.29
PB0: length 14.4
  Top Layer w0.254: U1.47 11.35,30.56 10.92,30.99 v1(10.03,30.99)
  Bottom Layer w0.254: v1(10.03,30.99) 9.02,30.99 6.28,33.72 6.28,35.63 5.72,36.2 3.17,36.2 2.16,35.18
PB1: length 8.8
  Top Layer w0.254: U1.48 v1(10.16,29.25)
  Bottom Layer w0.254: H2.28 10.12,29.25 v1(10.16,29.25)
PB2: length 13
  Top Layer w0.254: 2.16,32.64 3.17,33.66 5.84,33.66 6.6,32.89 6.6,30.23 7.24,29.59 7.24,27.18 7.67,26.75 U1.50
PB3: length 8.7
  Top Layer w0.254: H2.26 6.1,30.73 6.1,29.97 6.86,29.21 6.86,26.92 7.54,26.25 U1.51
PB4: length 11.1
  Top Layer w0.254: 2.16,30.1 3.3,31.24 4.83,31.24 5.61,30.45 5.61,29.44 6.48,28.58 6.48,26.8 7.53,25.75 U1.52
PB5: length 7.2
  Top Layer w0.254: H2.24 6.1,28.19 6.1,26.67 7.52,25.25 U1.53
PB6: length 7.5
  Top Layer w0.254: 2.16,22.48 2.16,22.6 3.05,23.5 4.95,23.5 5.7,22.75 U1.58
PB7: length 4.4
  Top Layer w0.254: U1.59 4.92,22.25 4.9,22.23 H2.18
PB8: length 7.4
  Top Layer w0.254: 2.16,19.94 3.17,20.95 5.46,20.95 6.25,21.75 U1.60
PB9: length 5.1
  Top Layer w0.254: U1.61 6.77,21.25 5.21,19.69 H2.16
PB10: length 8.6
  Top Layer w0.254: 1.65,17.4 2.67,18.42 5.08,18.42 7.41,20.75 U1.62
PB11: length 5.7
  Top Layer w0.254: H2.14 4.57,17.14 7.67,20.25 U1.63
PB12: length 9.4
  Top Layer w0.254: U1.64 8.85,18.51 6.22,15.88 3.17,15.88 2.16,14.86
PB13: length 8.5
  Top Layer w0.254: H2.12 9.02,14.61 10.85,16.44 U1.1
PB14: length 12.9
  Top Layer w0.254: 1.65,12.32 2.67,13.34 8.51,13.34 11.35,16.18 U1.2
PB15: length 10.8
  Top Layer w0.254: H2.10 8,12.06 11.85,15.92 U1.3
PB16: length 15.2
  Top Layer w0.254: 1.65,9.78 2.7,10.82 7.39,10.82 12.35,15.78 U1.4
PB17: length 16.1
  Top Layer w0.254: H1.8 26.03,8.25 24,8.25 21.59,10.67 21.59,11.92 17.35,16.15 U1.14
PB18: length 11.6
  Top Layer w0.254: U1.15 17.85,16.31 24.64,9.53 H1.7 ; 24.76,9.17 24.91,9.17 25.12,9.38
PB19: length 13.9
  Top Layer w0.254: 27.56,12.32 27.66,12.21 27.66,11.92 26.54,10.8 24,10.8 22.61,12.19 22.61,13.49 U1.16
PB20: length 8.7
  Top Layer w0.254: H1.11 22.22,17.14 22.22,20.19 21.67,20.75 U1.19
PB21: length 11.1
  Top Layer w0.254: U1.20 21.81,21.25 22.61,20.45 22.61,17.4 24.13,15.88 26.03,15.88 27.05,16.89
PB22: length 7.4
  Top Layer w0.254: U1.21 22.07,21.75 22.99,20.83 22.99,18.92 H1.13
PB23: length 10.3
  Top Layer w0.254: 27.56,19.43 26.54,18.42 24.13,18.42 23.49,19.05 23.49,20.95 22.2,22.25 U1.22
PB24: length 6
  Top Layer w0.254: U1.23 22.34,22.75 24.76,20.32 H1.15
PB25: length 4.4
  Top Layer w0.254: H1.19 24.74,24.75 U1.27
PB26: length 7.4
  Top Layer w0.254: 27.05,27.05 26.03,26.03 22.86,26.03 22.07,25.25 U1.28
PB27: length 5.1
  Top Layer w0.254: H1.21 23.49,27.31 21.94,25.75 U1.29
RST: length 24.3
  Top Layer w0.254: v1(17.91,24.59) 17.91,20.95 v1(17.84,20.89) ; v1(20.47,11.94) SW2.2 SW2.1 v1(15.37,9.76)
  Bottom Layer w0.254: v1(20.47,11.94) 20.47,15.85 19.05,17.27 19.05,19.69 v1(17.84,20.89) 17.83,20.9 R4.1 ; C3.1 14.66,9.76 v1(15.37,9.76) ; R6.2 v1(17.91,24.59)
SWCLK: length 16.2
  Top Layer w0.254: H3.8 14.73,7.64 14.73,10.03 16.85,12.16 U1.13
SWDIO: length 15.4
  Top Layer w0.254: H3.6 14.22,5.61 14.22,10.16 16.35,12.29 U1.12
$1N614: length 2.4
  Top Layer w0.254: U1.32 v1(18.8,27.25)
  Bottom Layer w0.254: v1(18.8,27.25) 18.01,27.25 C6.2
$1N707: length 4.1
  Top Layer w0.254: v1(16.51,26.16) 15.88,26.8 15.88,29.22 U1.38
  Bottom Layer w0.254: v1(16.51,26.16) R6.1
$1N2317: length 8
  Bottom Layer w0.508: 19.5,7.77 C1.2 ; 19.5,7.77 19.5,8.49 U2.1 19.49,9.23 19.07,9.65 18.01,9.65 17.59,9.23 U2.3 ; 19.5,7.77 19.52,7.8 D1.1
$1N3253: length 2.4
  Top Layer w0.762: LED1.1 20.48,2.96 v1(20.45,2.92)
  Bottom Layer w0.762: R1.2 20.46,2.91 v1(20.45,2.92)
$1N3286: length 2.4
  Top Layer w0.762: LED2.1 7.29,2.91 v1(8.76,2.91)
  Bottom Layer w0.762: R2.2 v1(8.76,2.91)
$1N5118: length 9.7
  Top Layer w0.508: v1(18.03,5.84) 18.03,7.75 18.92,8.64 v1(20.57,8.64)
  Bottom Layer w0.508: v1(20.57,8.64) 20.57,9.27 20.89,9.59 C2.1 ; v1(18.03,5.84) 18.03,6.54 C1.1 18.1,7.3 18.54,7.75 U2.2

## Copper pours and planes (outline as drawn; the poured copper is in the pictures)
GND on Top Layer: -5.46,43.43 35.43,43.43 35.43,-6.1 -5.46,-6.1
GND on Bottom Layer: -1.14,40.26 31.62,40.26 31.62,-2.16 -1.14,-2.16

Small or netless copper shapes (teardrops, artwork), in the pictures only: 163 on Top Layer, 145 on Bottom Layer

## Text on the board
Top Silkscreen Layer: DIO / TXD | CLK / RXD | PA14 | PWR | PB25 | PA13 | PA29 | PA1 | PA27 | PB27 | PA24 | PB24 | PB22 | PB20 | PA21 | PB18 | 3V3 | 5V | GND | PA25 | PA30 | PA28 | PA0 | PA26 | PB26 | PA23 | PB23 | PB21 | PA22 | PB19 | PB17 | PA2 | PB0 | PB2 | PB4 | PA8 | PA10 | PB6 | PB8 | PB10 | PB12 | PB14 | PB16 | PA15 | PA17 | PA7 | PB1 | PB3 | PB5 | PA9 | PA11 | PB7 | PB9 | PB11 | PB13 | PB15 | PA12 | PA16 | PA18 | RST | MSPM0G3507 | 核心板
